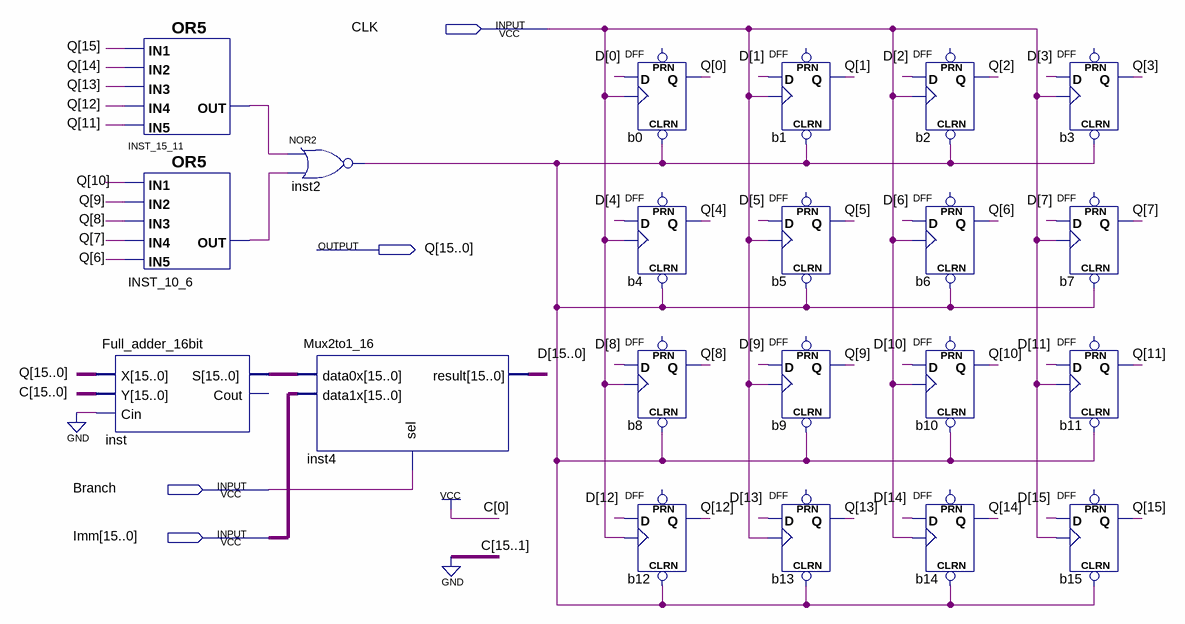
[diagram p0: schematic sheet]
// Quartus schematic PC.bdf as structural Verilog: 21 symbols, 4 pins
module PC (
  input  CLK,
  input  Branch,
  input  [15:0] Imm,
  output [15:0] Q
);

  wire inst2_out, INST_10_6_out, INST_15_11_out;
  wire [15:0] D, inst_s;

  Full_adder_16bit inst (.X(Q), .Y(16'b0000000000000001), .Cin(1'b0), .S(inst_s));  // open: Cout
  or INST_15_11 (INST_15_11_out, Q[15], Q[14], Q[13], Q[12], Q[11]);
  or INST_10_6 (INST_10_6_out, Q[10], Q[9], Q[8], Q[7], Q[6]);
  nor inst2 (inst2_out, INST_15_11_out, INST_10_6_out);
  Mux2to1_16 inst4 (.data0x(inst_s), .data1x(Imm), .sel(Branch), .result(D));
  DFF b0 (.CLRN(inst2_out), .CLK(CLK), .D(D[0]), .Q(Q[0]));  // open: PRN
  DFF b4 (.CLRN(inst2_out), .CLK(CLK), .D(D[4]), .Q(Q[4]));  // open: PRN
  DFF b8 (.CLRN(inst2_out), .CLK(CLK), .D(D[8]), .Q(Q[8]));  // open: PRN
  DFF b12 (.CLRN(inst2_out), .CLK(CLK), .D(D[12]), .Q(Q[12]));  // open: PRN
  DFF b1 (.CLRN(inst2_out), .CLK(CLK), .D(D[1]), .Q(Q[1]));  // open: PRN
  DFF b5 (.CLRN(inst2_out), .CLK(CLK), .D(D[5]), .Q(Q[5]));  // open: PRN
  DFF b9 (.CLRN(inst2_out), .CLK(CLK), .D(D[9]), .Q(Q[9]));  // open: PRN
  DFF b13 (.CLRN(inst2_out), .CLK(CLK), .D(D[13]), .Q(Q[13]));  // open: PRN
  DFF b2 (.CLRN(inst2_out), .CLK(CLK), .D(D[2]), .Q(Q[2]));  // open: PRN
  DFF b6 (.CLRN(inst2_out), .CLK(CLK), .D(D[6]), .Q(Q[6]));  // open: PRN
  DFF b10 (.CLRN(inst2_out), .CLK(CLK), .D(D[10]), .Q(Q[10]));  // open: PRN
  DFF b14 (.CLRN(inst2_out), .CLK(CLK), .D(D[14]), .Q(Q[14]));  // open: PRN
  DFF b3 (.CLRN(inst2_out), .CLK(CLK), .D(D[3]), .Q(Q[3]));  // open: PRN
  DFF b7 (.CLRN(inst2_out), .CLK(CLK), .D(D[7]), .Q(Q[7]));  // open: PRN
  DFF b11 (.CLRN(inst2_out), .CLK(CLK), .D(D[11]), .Q(Q[11]));  // open: PRN
  DFF b15 (.CLRN(inst2_out), .CLK(CLK), .D(D[15]), .Q(Q[15]));  // open: PRN
endmodule
